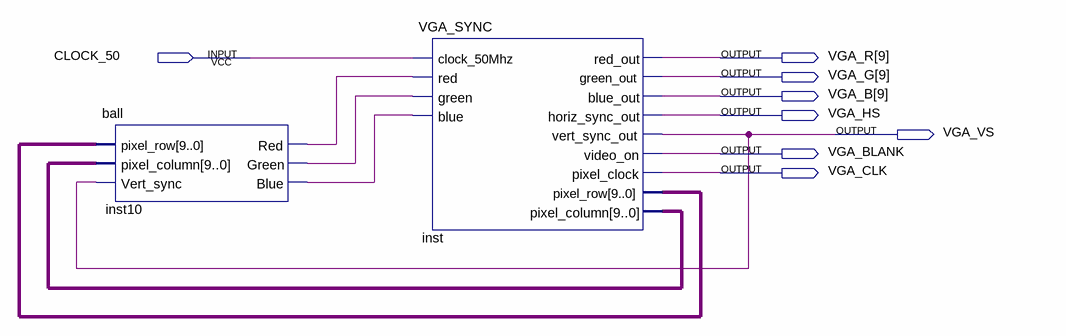
[diagram p0: schematic sheet]
// Quartus schematic Pong.bdf as structural Verilog: 2 symbols, 8 pins
module Pong (
  input  CLOCK_50,
  output [9:9] VGA_R,
  output [9:9] VGA_G,
  output [9:9] VGA_B,
  output VGA_HS,
  output VGA_VS,
  output VGA_BLANK,
  output VGA_CLK
);

  wire inst10_blue, inst10_green, inst10_red;
  wire [9:0] inst_pixel_column, inst_pixel_row;

  ball inst10 (
    .pixel_row(inst_pixel_row), .pixel_column(inst_pixel_column), .Vert_sync(VGA_VS), .Red(inst10_red),
    .Green(inst10_green), .Blue(inst10_blue));
  VGA_SYNC inst (
    .clock_50Mhz(CLOCK_50), .red(inst10_red), .green(inst10_green), .blue(inst10_blue), .red_out(VGA_R[9]),
    .green_out(VGA_G[9]), .blue_out(VGA_B[9]), .horiz_sync_out(VGA_HS), .vert_sync_out(VGA_VS),
    .video_on(VGA_BLANK), .pixel_clock(VGA_CLK), .pixel_row(inst_pixel_row), .pixel_column(inst_pixel_column));
endmodule
